# Altium schematic sheet LDO_SOT-23-5.schdoc
size 127 x 101 mm
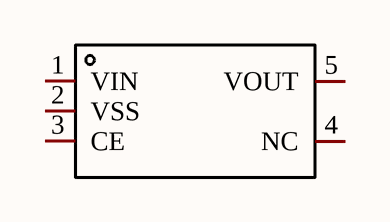
[diagram p0: LDO_SOT-23-5.schdoc]

## Parts
LDO?  ME6211C33M5G-N  [SOT-23-5_L3.0-W1.7-P0.95-LS2.8-BL]  (value not drawn)

## Nets

Not connected (* = marked no-connect by the designer): LDO? 1(VIN) 2(VSS) 3(CE) 4(NC) 5(VOUT)

## Library data of the parts
LDO? = ME6211C33M5G-N: Manufacturer: MICRONE(南京微盟); Add into BOM: yes; Output Type: 固定; Maximum Input Voltage: 6V; Output Voltage: 3.3V; MAX Output Current: 500mA; Power Supply Rejection Ratio (PSRR): 70dB; Dropout Voltage: 260mV@(200mA); Output Polarity: 正极; Number of Outputs: 1; Symbol: ME6211C33M5G-N; Device: ME6211C33M5G-N; LCSC Part Name: 输入6V 输出3.3V 500mA; Supplier Part: C82942; Manufacturer Part: ME6211C33M5G-N; Supplier Footprint: SOT-23-5; JLCPCB Part Class: Extended Part; Datasheet: https://atta.szlcsc.com/upload/public/pdf/source/20170918/C82942_1505727073070976520.pdf; Supplier: LCSC; Convert to PCB: yes